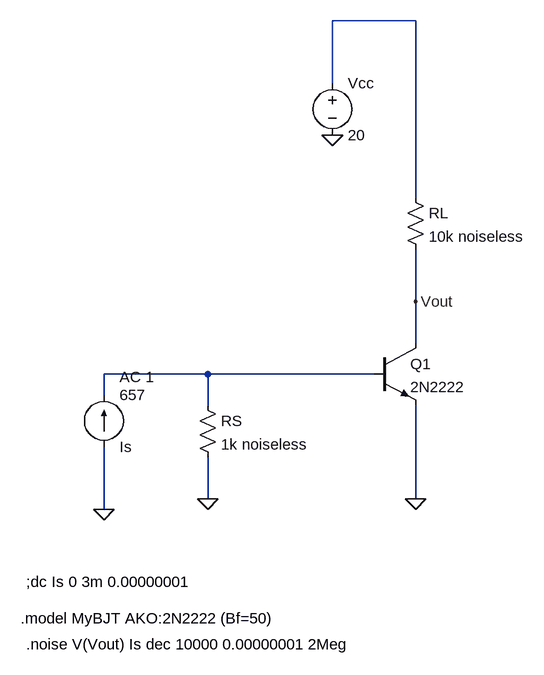
[diagram p0: schematic 4_theoritiki.asc]
4_theoritiki.asc, the LTspice schematic file:
Version 4
SHEET 1 880 680
WIRE 544 -400 416 -400
WIRE 416 -304 416 -400
WIRE 544 -128 544 -400
WIRE 544 32 544 -48
WIRE 544 96 544 32
WIRE 224 144 64 144
WIRE 480 144 224 144
WIRE 64 176 64 144
WIRE 224 192 224 144
WIRE 224 336 224 272
WIRE 544 336 544 192
WIRE 64 352 64 256
FLAG 64 352 0
FLAG 544 336 0
FLAG 416 -224 0
FLAG 544 32 Vout
FLAG 224 336 0
SYMBOL current 64 256 M180
WINDOW 123 24 108 Left 2
WINDOW 39 0 0 Left 0
SYMATTR InstName Is
SYMATTR Value 657
SYMATTR Value2 AC 1
SYMBOL res 208 176 R0
SYMATTR InstName RS
SYMATTR Value 1k noiseless
SYMBOL npn 480 96 R0
SYMATTR InstName Q1
SYMATTR Value 2N2222
SYMBOL res 528 -144 R0
SYMATTR InstName RL
SYMATTR Value 10k noiseless
SYMBOL voltage 416 -320 R0
SYMATTR InstName Vcc
SYMATTR Value 20
TEXT -56 464 Left 2 !;dc Is 0 3m 0.00000001
TEXT -64 520 Left 2 !.model MyBJT AKO:2N2222 (Bf=50)
TEXT -56 560 Left 2 !.noise V(Vout) Is dec 10000 0.00000001 2Meg

The netlist it stands for:
* 4_theoritiki.asc
Is 0 N002 657 AC 1
RS N002 0 1k noiseless
Q1 Vout N002 0 0 2N2222
RL N001 Vout 10k noiseless
Vcc N001 0 20
.model NPN NPN
.model PNP PNP
.lib standard.bjt
;dc Is 0 3m 0.00000001
.model MyBJT AKO:2N2222 (Bf=50)
.noise V(Vout) Is dec 10000 0.00000001 2Meg
.backanno
.end